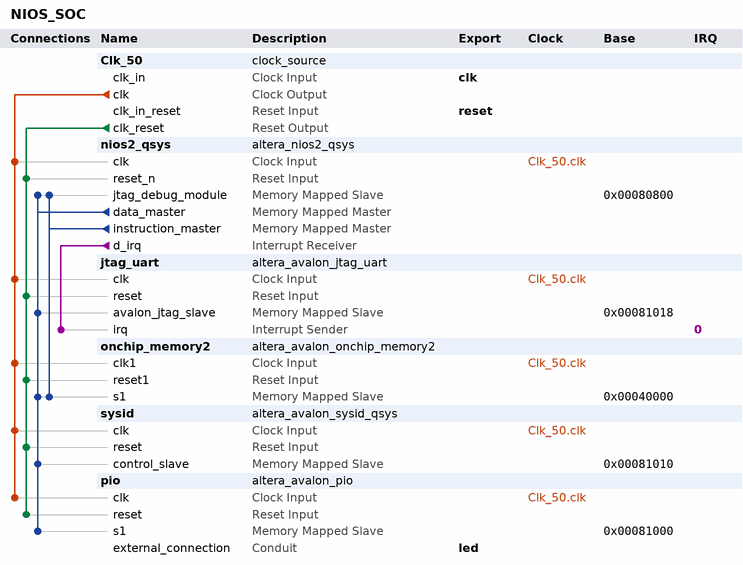
[diagram p0: system contents]
# Platform Designer (Qsys) system NIOS_SOC, Cyclone IV E EP4CE115F29C8
# Parameters at their usual value, and those the tool derives, are not listed.
package require -exact qsys 16.0
create_system NIOS_SOC
set_project_property DEVICE_FAMILY {Cyclone IV E}
set_project_property DEVICE EP4CE115F29C8

add_instance Clk_50 clock_source 16.0
set_instance_parameter_value Clk_50 clockFrequency 50000000

add_instance nios2_qsys altera_nios2_qsys 16.0
set_instance_parameter_value nios2_qsys breakSlave nios2_qsys.jtag_debug_module
set_instance_parameter_value nios2_qsys exceptionSlave onchip_memory2.s1
set_instance_parameter_value nios2_qsys icache_size 4096
set_instance_parameter_value nios2_qsys impl Fast
set_instance_parameter_value nios2_qsys mmu_TLBMissExcSlave None
set_instance_parameter_value nios2_qsys resetSlave onchip_memory2.s1
set_instance_parameter_value nios2_qsys resetrequest_enabled true

add_instance jtag_uart altera_avalon_jtag_uart 16.0
set_instance_parameter_value jtag_uart simInteractiveOptions NO_INTERACTIVE_WINDOWS

add_instance onchip_memory2 altera_avalon_onchip_memory2 16.0
set_instance_parameter_value onchip_memory2 dataWidth 32
set_instance_parameter_value onchip_memory2 dualPort false
set_instance_parameter_value onchip_memory2 initMemContent true
set_instance_parameter_value onchip_memory2 initializationFileName onchip_mem.hex
set_instance_parameter_value onchip_memory2 memorySize 204800

add_instance sysid altera_avalon_sysid_qsys 16.0
set_instance_parameter_value sysid id -1431651397

add_instance pio altera_avalon_pio 16.0
set_instance_parameter_value pio direction Output
set_instance_parameter_value pio width 8

# connections
add_connection Clk_50.clk jtag_uart.clk clock
add_connection Clk_50.clk nios2_qsys.clk clock
add_connection Clk_50.clk onchip_memory2.clk1 clock
add_connection Clk_50.clk pio.clk clock
add_connection Clk_50.clk sysid.clk clock
add_connection Clk_50.clk_reset jtag_uart.reset reset
add_connection Clk_50.clk_reset nios2_qsys.reset_n reset
add_connection Clk_50.clk_reset onchip_memory2.reset1 reset
add_connection Clk_50.clk_reset pio.reset reset
add_connection Clk_50.clk_reset sysid.reset reset
add_connection nios2_qsys.data_master jtag_uart.avalon_jtag_slave avalon
set_connection_parameter_value nios2_qsys.data_master/jtag_uart.avalon_jtag_slave baseAddress 0x00081018
add_connection nios2_qsys.data_master nios2_qsys.jtag_debug_module avalon
set_connection_parameter_value nios2_qsys.data_master/nios2_qsys.jtag_debug_module baseAddress 0x00080800
add_connection nios2_qsys.data_master onchip_memory2.s1 avalon
set_connection_parameter_value nios2_qsys.data_master/onchip_memory2.s1 baseAddress 0x00040000
add_connection nios2_qsys.data_master pio.s1 avalon
set_connection_parameter_value nios2_qsys.data_master/pio.s1 baseAddress 0x00081000
add_connection nios2_qsys.data_master sysid.control_slave avalon
set_connection_parameter_value nios2_qsys.data_master/sysid.control_slave baseAddress 0x00081010
add_connection nios2_qsys.instruction_master nios2_qsys.jtag_debug_module avalon
set_connection_parameter_value nios2_qsys.instruction_master/nios2_qsys.jtag_debug_module baseAddress 0x00080800
add_connection nios2_qsys.instruction_master onchip_memory2.s1 avalon
set_connection_parameter_value nios2_qsys.instruction_master/onchip_memory2.s1 baseAddress 0x00040000
add_connection nios2_qsys.d_irq jtag_uart.irq interrupt
set_connection_parameter_value nios2_qsys.d_irq/jtag_uart.irq irqNumber 0

# exported interfaces
add_interface clk clock sink
set_interface_property clk EXPORT_OF Clk_50.clk_in
add_interface led conduit end
set_interface_property led EXPORT_OF pio.external_connection
add_interface reset reset sink
set_interface_property reset EXPORT_OF Clk_50.clk_in_reset

set_interconnect_requirement {$system} qsys_mm.clockCrossingAdapter HANDSHAKE
set_interconnect_requirement {$system} qsys_mm.enableEccProtection FALSE
set_interconnect_requirement {$system} qsys_mm.insertDefaultSlave FALSE
set_interconnect_requirement {$system} qsys_mm.maxAdditionalLatency 1

save_system NIOS_SOC.qsys
